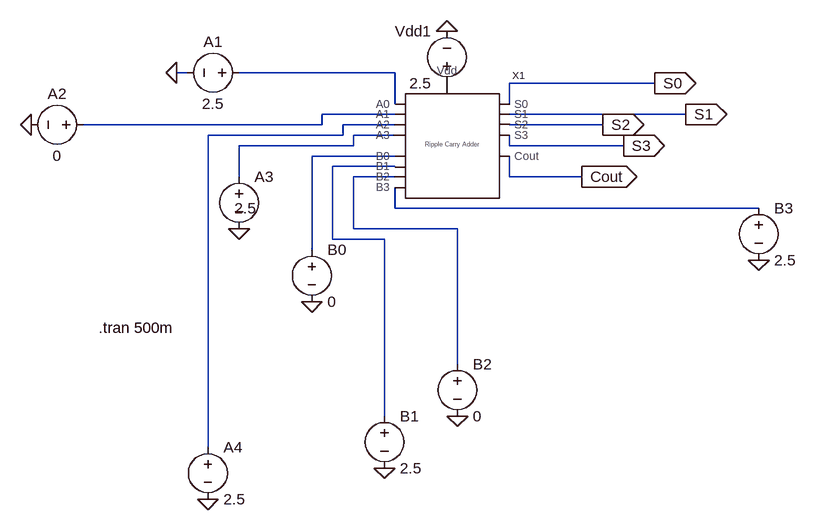
[diagram p0: schematic RippleAdder_DC.asc]
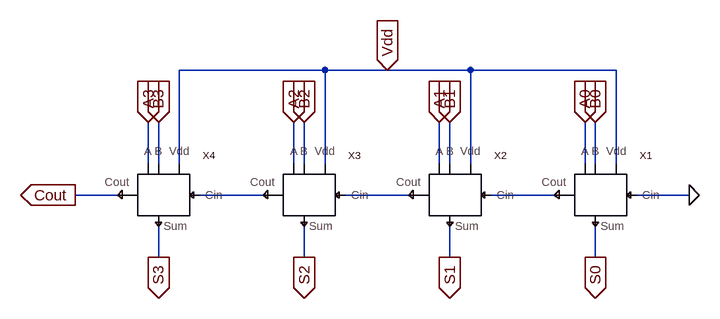
[diagram p1: sub-circuit rippleadder.asc]
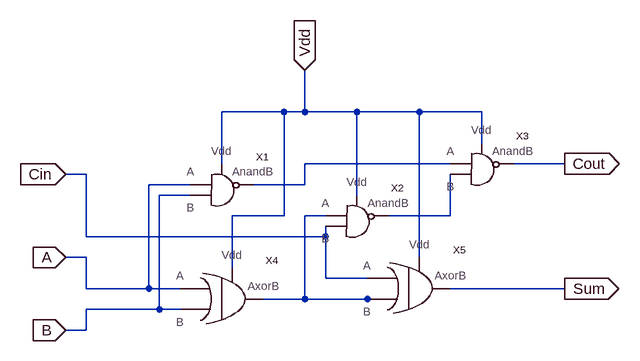
[diagram p2: sub-circuit fa.asc]
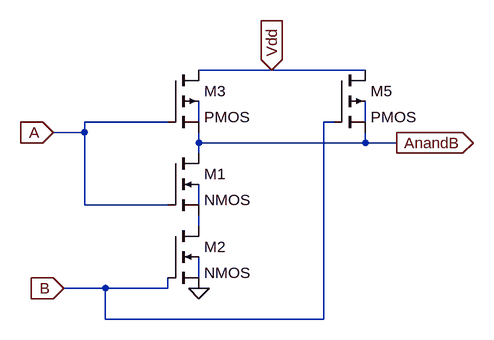
[diagram p3: sub-circuit nand.asc]
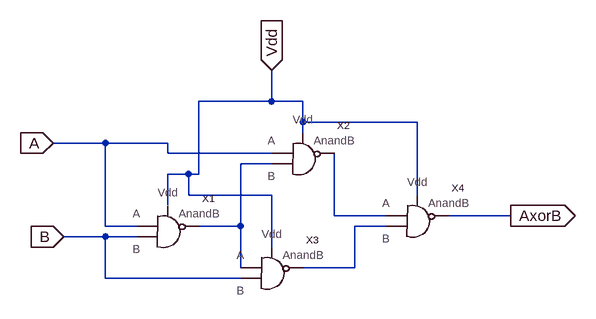
[diagram p4: sub-circuit xor.asc]
RippleAdder_DC.asc, the LTspice schematic file:
Version 4
SHEET 1 1320 692
WIRE 64 16 48 16
WIRE 384 16 144 16
WIRE 784 32 560 32
WIRE 384 64 384 16
WIRE 560 64 560 32
WIRE 384 80 272 80
WIRE 832 80 560 80
WIRE 272 96 272 80
WIRE 272 96 -96 96
WIRE 384 96 304 96
WIRE 704 96 560 96
WIRE 304 112 304 96
WIRE 304 112 96 112
WIRE 384 112 320 112
WIRE 320 128 320 112
WIRE 320 128 144 128
WIRE 560 128 560 112
WIRE 736 128 560 128
WIRE 384 144 256 144
WIRE 384 160 288 160
WIRE 144 176 144 128
WIRE 384 176 320 176
WIRE 560 176 560 144
WIRE 672 176 560 176
WIRE 384 224 384 192
WIRE 944 224 384 224
WIRE 320 256 320 176
WIRE 480 256 320 256
WIRE 288 272 288 160
WIRE 368 272 288 272
WIRE 256 288 256 144
WIRE 480 464 480 256
WIRE 368 544 368 272
WIRE 96 592 96 112
FLAG 144 256 0
FLAG 96 672 0
FLAG -176 96 0
FLAG 48 16 0
FLAG 368 624 0
FLAG 480 544 0
FLAG 944 304 0
FLAG 256 368 0
FLAG 464 -48 0
FLAG 784 32 S0
IOPIN 784 32 Out
FLAG 832 80 S1
IOPIN 832 80 Out
FLAG 704 96 S2
IOPIN 704 96 Out
FLAG 736 128 S3
IOPIN 736 128 Out
FLAG 672 176 Cout
IOPIN 672 176 Out
SYMBOL RippleAdder 464 112 R0
SYMATTR InstName X1
SYMBOL voltage 160 16 R90
WINDOW 0 -32 56 VBottom 2
WINDOW 3 32 56 VTop 2
WINDOW 123 0 0 Left 0
WINDOW 39 0 0 Left 0
SYMATTR InstName A1
SYMATTR Value 2.5
SYMBOL voltage -80 96 R90
WINDOW 0 -32 56 VBottom 2
WINDOW 3 32 56 VTop 2
WINDOW 123 0 0 Left 0
WINDOW 39 0 0 Left 0
SYMATTR InstName A2
SYMATTR Value 0
SYMBOL voltage 144 160 R0
WINDOW 3 -7 64 Left 2
WINDOW 123 0 0 Left 0
WINDOW 39 0 0 Left 0
SYMATTR Value 2.5
SYMATTR InstName A3
SYMBOL voltage 96 576 R0
WINDOW 123 0 0 Left 0
WINDOW 39 0 0 Left 0
SYMATTR InstName A4
SYMATTR Value 2.5
SYMBOL voltage 256 272 R0
WINDOW 123 0 0 Left 0
WINDOW 39 0 0 Left 0
SYMATTR InstName B0
SYMATTR Value 0
SYMBOL voltage 368 528 R0
WINDOW 123 0 0 Left 0
WINDOW 39 0 0 Left 0
SYMATTR InstName B1
SYMATTR Value 2.5
SYMBOL voltage 480 448 R0
WINDOW 123 0 0 Left 0
WINDOW 39 0 0 Left 0
SYMATTR InstName B2
SYMATTR Value 0
SYMBOL voltage 944 208 R0
WINDOW 123 0 0 Left 0
WINDOW 39 0 0 Left 0
SYMATTR InstName B3
SYMATTR Value 2.5
SYMBOL voltage 464 48 R180
WINDOW 0 24 96 Left 2
WINDOW 3 24 16 Left 2
WINDOW 123 0 0 Left 0
WINDOW 39 0 0 Left 0
SYMATTR InstName Vdd1
SYMATTR Value 2.5
TEXT -72 408 Left 2 !.tran 500m

rippleadder.asc, the sub-circuit schematic file:
Version 4
SHEET 1 880 680
WIRE 32 -32 -192 -32
WIRE 128 -32 32 -32
WIRE 256 -32 128 -32
WIRE 480 -32 256 -32
WIRE -240 112 -240 48
WIRE -224 112 -224 48
WIRE -192 112 -192 -32
WIRE -16 112 -16 48
WIRE 0 112 0 48
WIRE 32 112 32 -32
WIRE 208 112 208 48
WIRE 224 112 224 48
WIRE 256 112 256 -32
WIRE 432 112 432 48
WIRE 448 112 448 48
WIRE 480 112 480 -32
WIRE -288 160 -352 160
WIRE -64 160 -160 160
WIRE 160 160 64 160
WIRE 384 160 288 160
WIRE 592 160 512 160
WIRE -224 256 -224 208
WIRE 0 256 0 208
WIRE 224 256 224 208
WIRE 448 256 448 208
FLAG 592 160 0
FLAG 432 48 A0
IOPIN 432 48 In
FLAG 448 48 B0
IOPIN 448 48 In
FLAG 208 48 A1
IOPIN 208 48 In
FLAG 224 48 B1
IOPIN 224 48 In
FLAG 0 48 B2
IOPIN 0 48 In
FLAG -224 48 B3
IOPIN -224 48 In
FLAG -240 48 A3
IOPIN -240 48 In
FLAG -16 48 A2
IOPIN -16 48 In
FLAG 128 -32 Vdd
IOPIN 128 -32 In
FLAG -224 256 S3
IOPIN -224 256 Out
FLAG 0 256 S2
IOPIN 0 256 Out
FLAG 224 256 S1
IOPIN 224 256 Out
FLAG 448 256 S0
IOPIN 448 256 Out
FLAG -352 160 Cout
IOPIN -352 160 Out
SYMBOL FA 464 176 R0
SYMATTR InstName X1
SYMBOL FA 240 176 R0
SYMATTR InstName X2
SYMBOL FA 16 176 R0
SYMATTR InstName X3
SYMBOL FA -208 176 R0
SYMATTR InstName X4

fa.asc, the sub-circuit schematic file:
Version 4
SHEET 1 880 680
WIRE -16 -48 -112 -48
WIRE 16 -48 16 -112
WIRE 16 -48 -16 -48
WIRE 96 -48 16 -48
WIRE 192 -48 96 -48
WIRE 288 -48 192 -48
WIRE 288 0 288 -48
WIRE -112 32 -112 -48
WIRE 240 32 16 32
WIRE 416 32 336 32
WIRE -320 48 -352 48
WIRE -160 64 -224 64
WIRE 16 64 16 32
WIRE 16 64 -64 64
WIRE -160 80 -208 80
WIRE 96 80 96 -48
WIRE -16 112 -16 -48
WIRE -16 112 -96 112
WIRE 48 112 16 112
WIRE 240 112 240 48
WIRE 240 112 144 112
WIRE -320 144 -320 48
WIRE 48 144 48 128
WIRE 48 144 -320 144
WIRE -320 176 -352 176
WIRE 192 176 192 -48
WIRE -96 192 -96 112
WIRE 48 208 48 144
WIRE 112 208 48 208
WIRE -320 224 -320 176
WIRE -224 224 -224 64
WIRE -224 224 -320 224
WIRE -176 224 -224 224
WIRE 416 224 240 224
WIRE 16 240 16 112
WIRE 16 240 -48 240
WIRE 112 240 16 240
WIRE 128 240 112 240
WIRE -208 256 -208 80
WIRE -208 256 -320 256
WIRE -176 256 -208 256
WIRE -320 288 -320 256
WIRE -320 288 -352 288
FLAG 416 224 Sum
IOPIN 416 224 Out
FLAG 416 32 Cout
IOPIN 416 32 Out
FLAG -352 48 Cin
IOPIN -352 48 In
FLAG -352 176 A
IOPIN -352 176 In
FLAG -352 288 B
IOPIN -352 288 In
FLAG 16 -112 Vdd
IOPIN 16 -112 In
SYMBOL NAND -64 112 R0
SYMATTR InstName X1
SYMBOL NAND 144 160 R0
SYMATTR InstName X2
SYMBOL NAND 336 80 R0
SYMATTR InstName X3
SYMBOL XOR -80 272 R0
SYMATTR InstName X4
SYMBOL XOR 208 256 R0
SYMATTR InstName X5

nand.asc, the sub-circuit schematic file:
Version 4
SHEET 1 880 680
WIRE 256 16 144 16
WIRE 400 16 256 16
WIRE 96 96 -32 96
WIRE 144 96 144 64
WIRE 352 96 336 96
WIRE 400 96 400 64
WIRE -32 112 -32 96
WIRE -32 112 -80 112
WIRE 144 128 144 112
WIRE 400 128 400 112
WIRE 400 128 144 128
WIRE 448 128 400 128
WIRE 144 144 144 128
WIRE -32 224 -32 112
WIRE 96 224 -32 224
WIRE 144 224 144 192
WIRE 144 256 144 240
WIRE 144 336 144 304
WIRE 0 352 -64 352
WIRE 96 352 96 336
WIRE 96 352 0 352
WIRE 0 400 0 352
WIRE 336 400 336 96
WIRE 336 400 0 400
FLAG 144 352 0
FLAG 448 128 AnandB
IOPIN 448 128 Out
FLAG -80 112 A
IOPIN -80 112 In
FLAG -64 352 B
IOPIN -64 352 In
FLAG 256 16 Vdd
IOPIN 256 16 In
SYMBOL nmos4 96 144 R0
SYMATTR InstName M1
SYMATTR Value2 l=2 w=10
SYMBOL nmos4 96 256 R0
SYMATTR InstName M2
SYMATTR Value2 l=2 w=10
SYMBOL pmos4 96 16 R0
SYMATTR InstName M3
SYMATTR Value2 l=2 w=10
SYMBOL pmos4 352 16 R0
SYMATTR InstName M5
SYMATTR Value2 l=2 w=10

xor.asc, the sub-circuit schematic file:
Version 4
SHEET 1 1324 680
WIRE 112 -256 112 -304
WIRE 112 -256 0 -256
WIRE 160 -256 112 -256
WIRE 160 -224 160 -256
WIRE 336 -224 160 -224
WIRE 160 -208 160 -224
WIRE -144 -192 -224 -192
WIRE -48 -192 -144 -192
WIRE -48 -176 -48 -192
WIRE 112 -176 -48 -176
WIRE 112 -160 64 -160
WIRE -16 -144 -48 -144
WIRE 0 -144 0 -256
WIRE 0 -144 -16 -144
WIRE -16 -112 -16 -144
WIRE 112 -112 -16 -112
WIRE 336 -112 336 -224
WIRE -48 -96 -48 -144
WIRE 208 -80 208 -176
WIRE 288 -80 208 -80
WIRE 480 -80 384 -80
WIRE -144 -64 -144 -192
WIRE -96 -64 -144 -64
WIRE 64 -64 64 -160
WIRE 64 -64 0 -64
WIRE 288 -64 240 -64
WIRE -144 -48 -208 -48
WIRE -96 -48 -144 -48
WIRE 112 -32 112 -112
WIRE 64 0 64 -64
WIRE 240 0 240 -64
WIRE 240 0 160 0
WIRE -144 16 -144 -48
WIRE 64 16 -144 16
FLAG -224 -192 A
IOPIN -224 -192 In
FLAG -208 -48 B
IOPIN -208 -48 In
FLAG 112 -304 Vdd
IOPIN 112 -304 In
FLAG 480 -80 AxorB
IOPIN 480 -80 Out
SYMBOL NAND 0 -16 R0
SYMATTR InstName X1
SYMBOL NAND 208 -128 R0
SYMATTR InstName X2
SYMBOL NAND 160 48 R0
SYMATTR InstName X3
SYMBOL NAND 384 -32 R0
SYMATTR InstName X4

The netlist it stands for:
* RippleAdder_DC.asc
XX1 P001 N001 N002 N003 N004 N005 N006 N007 N008 S0 S1 S2 S3 Cout rippleadder
V§A1 N001 0 2.5
V§A2 N002 0 0
V§A3 N004 0 2.5
V§A4 N003 0 2.5
V§B0 N005 0 0
V§B1 N006 0 2.5
V§B2 N007 0 0
V§B3 N008 0 2.5
Vdd1 P001 0 2.5

* block symbol definitions
.subckt rippleadder Vdd A0 A1 A2 A3 B0 B1 B2 B3 S0 S1 S2 S3 Cout
XX1 A0 B0 Vdd 0 N003 S0 fa
XX2 A1 B1 Vdd N003 N002 S1 fa
XX3 A2 B2 Vdd N002 N001 S2 fa
XX4 A3 B3 Vdd N001 Cout S3 fa
.ends rippleadder

.subckt fa A B Vdd Cin Cout Sum
XX1 A B N001 Vdd nand
XX2 N002 Cin N003 Vdd nand
XX3 N001 N003 Cout Vdd nand
XX4 N002 A B Vdd xor
XX5 Sum Cin N002 Vdd xor
.ends fa

.subckt nand A B AnandB Vdd
M1 AnandB A N004 N003 NMOS l=2 w=10
M2 N004 B 0 N005 NMOS l=2 w=10
M3 Vdd A AnandB N001 PMOS l=2 w=10
M5 Vdd B AnandB N002 PMOS l=2 w=10
.ends nand

.subckt xor AxorB A B Vdd
XX1 A B N001 Vdd nand
XX2 A N001 N002 Vdd nand
XX3 N001 B N003 Vdd nand
XX4 N002 N003 AxorB Vdd nand
.ends xor

.model NMOS NMOS
.model PMOS PMOS
.lib standard.mos
.tran 500m
.backanno
.end